# Altium schematic sheet Resolver.SchDoc
size A4; SheetNumber: 4; SheetTotal: 4
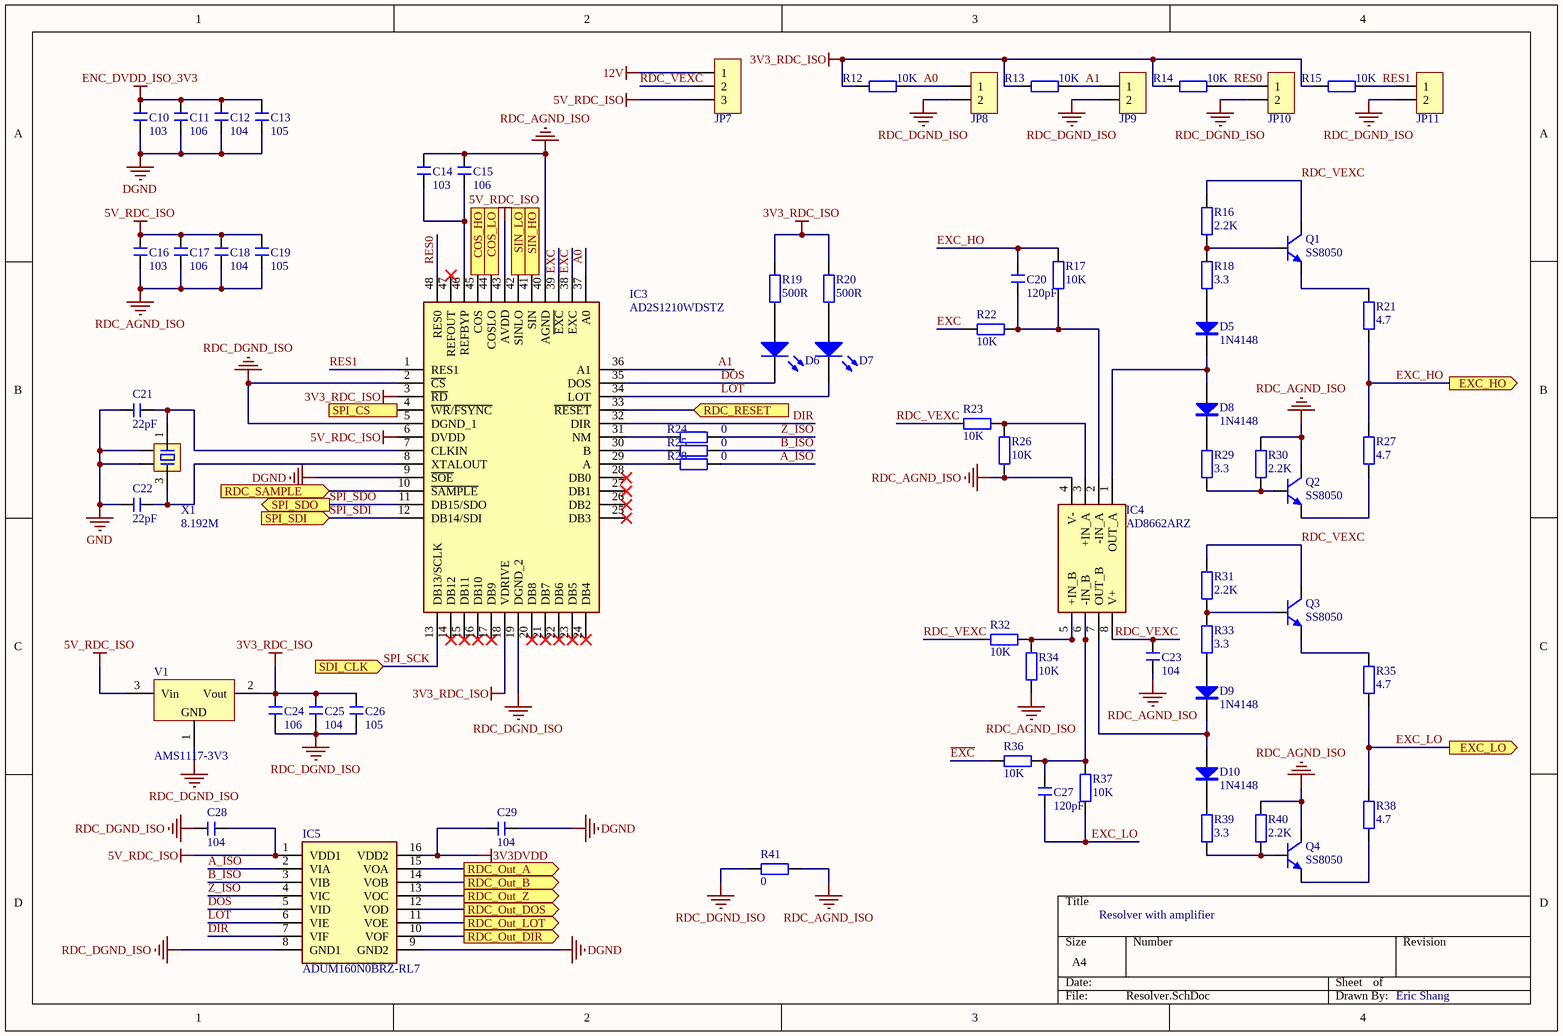
[diagram p0: Resolver.SchDoc]

## Parts
C10  103  [C 0603_L]
C11  106  [C 0603_L]
C12  104  [C 0603_L]
C13  105  [C 0603_L]
C14  103  [C 0603_L]
C15  106  [C 0603_L]
C16  103  [C 0603_L]
C17  106  [C 0603_L]
C18  104  [C 0603_L]
C19  105  [C 0603_L]
C20  120pF  [C 0603_L]
C21  22pF  [C 0603_L]
C22  22pF  [C 0603_L]
C23  104  [C 0603_L]
C24  106  [C 0603_L]
C25  104  [C 0603_L]
C26  105  [C 0603_L]
C27  120pF  [C 0603_L]
C28  104  [C 0603_L]
C29  104  [C 0603_L]
D5  1N4148  [MINI_MELF (LL34)]
D6  LED  [LED 0603W]  (value not drawn)
D7  LED  [LED 0603W]  (value not drawn)
D8  1N4148  [MINI_MELF (LL34)]
D9  1N4148  [MINI_MELF (LL34)]
D10  1N4148  [MINI_MELF (LL34)]
IC3  AD2S1210WDSTZ  [QFP50P900X900X160-48N]
IC4  AD8662ARZ  [SOIC127P600X175-8N]
IC5  ADUM160N0BRZ-RL7  [SOIC127P600X175-16N]
JP7  HDR-1X3  [HDR2.54-LI-3P]  (value not drawn)
JP8  HDR-1X2  [HDR2.54-LI-2P]  (value not drawn)
JP9  HDR-1X2  [HDR2.54-LI-2P]  (value not drawn)
JP10  HDR-1X2  [HDR2.54-LI-2P]  (value not drawn)
JP11  HDR-1X2  [HDR2.54-LI-2P]  (value not drawn)
Q1  SS8050  [SOT23-3N]
Q2  SS8050  [SOT23-3N]
Q3  SS8050  [SOT23-3N]
Q4  SS8050  [SOT23-3N]
R12  10K  [R 0603_L]
R13  10K  [R 0603_L]
R14  10K  [R 0603_L]
R15  10K  [R 0603_L]
R16  2.2K  [R 0603_L]
R17  10K  [R 0603_L]
R18  3.3  [R 0603_L]
R19  500R  [R 0603_L]
R20  500R  [R 0603_L]
R21  4.7  [R 1206_L]
R22  10K  [R 0603_L]
R23  10K  [R 0603_L]
R24  0  [R 0603_L]
R25  0  [R 0603_L]
R26  10K  [R 0603_L]
R27  4.7  [R 1206_L]
R28  0  [R 0603_L]
R29  3.3  [R 0603_L]
R30  2.2K  [R 0603_L]
R31  2.2K  [R 0603_L]
R32  10K  [R 0603_L]
R33  3.3  [R 0603_L]
R34  10K  [R 0603_L]
R35  4.7  [R 1206_L]
R36  10K  [R 0603_L]
R37  10K  [R 0603_L]
R38  4.7  [R 1206_L]
R39  3.3  [R 0603_L]
R40  2.2K  [R 0603_L]
R41  0  [R 1206_L]
V1  AMS1117-3V3  [SOT223_L]
X1  8.192M  [OSC 1612-4P]

## Ports
COS_HO (out), COS_LO (out), EXC_HO (out), EXC_LO (out), RDC_Out_A (out), RDC_Out_B (out), RDC_Out_DIR (out), RDC_Out_DOS (out), RDC_Out_LOT (out), RDC_Out_Z (out), RDC_RESET (in), RDC_SAMPLE (in), SDI_CLK (in), SIN_HO (out), SIN_LO (out), SPI_CS (in), SPI_SDI (in), SPI_SDO (out)

## Nets
3V3_RDC_ISO: C24.2 C25.2 C26.2 IC3.3(~{RD}) IC3.18(VDRIVE) R12.1 R13.1 R14.1 R15.1 R19.2 R20.2 V1.2(Vout)
3V3DVDD: C29.1 IC5.16(VDD2)
5V_RDC_ISO: C16.2 C17.2 C18.2 C19.2 C28.1 IC3.6(DVDD) IC3.43(AVDD) IC5.1(VDD1) JP7.3 V1.3(Vin)
12V: JP7.1
DGND: C10.1 C11.1 C12.1 C13.1 C29.2 IC3.9(~{SOE}) IC5.9(GND2)
ENC_DVDD_ISO_3V3: C10.2 C11.2 C12.2 C13.2
GND: C21.1 C22.1 X1.2 X1.4
RDC_AGND_ISO: C14.2 C15.2 C16.1 C17.1 C18.1 C19.1 C23.1 IC3.40(AGND) IC4.4(V-) Q2.3(C) Q4.3(C) R26.1 R30.2 R34.1 R40.2 R41.1
RDC_DGND_ISO: C24.1 C25.1 C26.1 C28.2 IC3.2(~{CS}) IC3.5(DGND_1) IC3.19(DGND_2) IC5.8(GND1) JP8.2 JP9.2 JP10.2 JP11.2 R41.2 V1.1(GND)
A0: IC3.37(A0) JP8.1 R12.2
A1: IC3.36(A1) JP9.1 R13.2
A_ISO: IC5.2(VIA) R28.2
B_ISO: IC5.3(VIB) R25.2
COS_HO: IC3.45(COS) ; port COS_HO
COS_LO: IC3.44(COSLO) ; port COS_LO
DIR: IC3.32(DIR) IC5.7(VIF)
DOS: D6.2(K) IC3.35(DOS) IC5.5(VID)
~{EXC}: IC3.39(~{EXC}) R36.1
EXC: IC3.38(EXC) R22.1
EXC_HO: C20.2 R17.2 R21.1 R27.2 ; port EXC_HO
EXC_LO: C27.1 R35.1 R37.1 R38.2 ; port EXC_LO
LOT: D7.2(K) IC3.34(LOT) IC5.6(VIE)
RDC_Out_A: IC5.15(VOA) ; port RDC_Out_A
RDC_Out_B: IC5.14(VOB) ; port RDC_Out_B
RDC_Out_DIR: IC5.10(VOF) ; port RDC_Out_DIR
RDC_Out_DOS: IC5.12(VOD) ; port RDC_Out_DOS
RDC_Out_LOT: IC5.11(VOE) ; port RDC_Out_LOT
RDC_Out_Z: IC5.13(VOC) ; port RDC_Out_Z
RDC_RESET: IC3.33(~{RESET}) ; port RDC_RESET
RDC_SAMPLE: IC3.10(~{SAMPLE}) ; port RDC_SAMPLE
RDC_VEXC: C23.2 IC4.8(V+) JP7.2 Q1.3(C) Q3.3(C) R16.2 R23.1 R31.2 R32.1
RES0: IC3.48(RES0) JP10.1 R14.2
RES1: IC3.1(RES1) JP11.1 R15.2
SIN_HO: IC3.41(SIN) ; port SIN_HO
SIN_LO: IC3.42(SINLO) ; port SIN_LO
SPI_CS: IC3.4(~{WR}/~{FSYNC}) ; port SPI_CS
SPI_SCK: IC3.13(DB13/SCLK) ; port SDI_CLK
SPI_SDI: IC3.12(DB14/SDI) ; port SPI_SDI
SPI_SDO: IC3.11(DB15/SDO) ; port SPI_SDO
Z_ISO: IC5.4(VIC) R24.2
NetC14_1: C14.1 C15.1 IC3.46(REFBYP)
NetC20_1: C20.1 IC4.2(-IN_A) R17.1 R22.2
NetC21_2: C21.2 IC3.7(CLKIN) X1.1
NetC22_2: C22.2 IC3.8(XTALOUT) X1.3
NetC27_2: C27.2 IC4.6(-IN_B) R36.2 R37.2
NetD5_1: D5.1(A) R18.1
NetD5_2: D5.2(K) D8.1(A) IC4.1(OUT_A)
NetD6_1: D6.1(A) R19.1
NetD7_1: D7.1(A) R20.1
NetD8_2: D8.2(K) R29.2
NetD9_1: D9.1(A) R33.1
NetD9_2: D9.2(K) D10.1(A) IC4.7(OUT_B)
NetD10_2: D10.2(K) R39.2
NetIC3_29: IC3.29(A) R28.1
NetIC3_30: IC3.30(B) R25.1
NetIC3_31: IC3.31(NM) R24.1
NetIC4_3: IC4.3(+IN_A) R23.2 R26.2
NetIC4_5: IC4.5(+IN_B) R32.2 R34.2
NetQ1_1: Q1.1(B) R16.1 R18.2
NetQ1_2: Q1.2(E) R21.2
NetQ2_1: Q2.1(B) R29.1 R30.1
NetQ2_2: Q2.2(E) R27.1
NetQ3_1: Q3.1(B) R31.1 R33.2
NetQ3_2: Q3.2(E) R35.2
NetQ4_1: Q4.1(B) R39.1 R40.1
NetQ4_2: Q4.2(E) R38.1

Not connected (* = marked no-connect by the designer): IC3 14(DB12)* 15(DB11)* 16(DB10)* 17(DB9)* 20(DB8)* 21(DB7)* 22(DB6)* 23(DB5)* 24(DB4)* 25(DB3)* 26(DB2)* 27(DB1)* 28(DB0)* 47(REFOUT)*

## Notes on the sheet
- Resolver with amplifier
- Eric Shang

## Library data of the parts
C10-C29 = C: 贴片电容; BOM名称: 无极性贴片电容; 淘宝ID: 封装库来自淘宝 ID：黄晶宝石; 联系售后，技术支持: https://shop463601444.taobao.com; 唯一出售店铺网址: https://shop463601444.taobao.com
D5 D8-D10 = 1N4148: 开关二极管; BOM名称: 高速开关二极管; 淘宝ID: 封装库来自淘宝 ID：黄晶宝石; 欢迎光临: https://shop463601444.taobao.com
D6 D7 = LED: 发光二极管; 技术支持，联系售后: https://shop463601444.taobao.com
IC3 = AD2S1210WDSTZ: Integrated Circuit; Manufacturer_Name: Analog Devices; Datasheet Link: https://www.analog.com/AD2S1210/datasheet; Height: 1.6mm; Manufacturer_Part_Number: AD2S1210WDSTZ; Mouser Part Number: 584-AD2S1210WDSTZ; Mouser Price/Stock: https://www.mouser.co.uk/ProductDetail/Analog-Devices/AD2S1210WDSTZ?qs=ZSGLvWohUNk0AkxKY2QFgw%3D%3D; Arrow Part Number: AD2S1210WDSTZ; Arrow Price/Stock: https://www.arrow.com/en/products/ad2s1210wdstz/analog-devices?region=asia
IC4 = AD8662ARZ: Integrated Circuit; Manufacturer_Name: Analog Devices; Datasheet Link: http://www.analog.com/static/imported-files/data_sheets/AD8661_8662.pdf; Height: 1.75mm; Manufacturer_Part_Number: AD8662ARZ; Mouser Part Number: 584-AD8662ARZ; Mouser Price/Stock: https://www.mouser.co.uk/ProductDetail/Analog-Devices/AD8662ARZ?qs=%2FtpEQrCGXCxD9FnBk1Cc6w%3D%3D; Arrow Part Number: AD8662ARZ; Arrow Price/Stock: https://www.arrow.com/en/products/ad8662arz/analog-devices?region=nac
IC5 = ADUM160N0BRZ-RL7: Integrated Circuit; Manufacturer_Name: Analog Devices; Datasheet Link: https://www.analog.com/media/en/technical-documentation/data-sheets/adum160n-161n-162n-163n.pdf; Height: 1.75mm; Manufacturer_Part_Number: ADUM160N0BRZ-RL7; Mouser Part Number: 584-ADUM160N0BRZ-RL7; Mouser Price/Stock: https://www.mouser.co.uk/ProductDetail/Analog-Devices/ADUM160N0BRZ-RL7?qs=cslStgdnz9OW1mXsMBZKfA%3D%3D; Arrow Part Number: ADUM160N0BRZ-RL7; Arrow Price/Stock: https://www.arrow.com/en/products/adum160n0brz-rl7/analog-devices
JP7 = Header 3: 3P接插件; 版权归属: 封装库来自淘宝 ID：黄晶宝石; BOM名称: 3P接插件; 学习资源: https://shop463601444.taobao.com
JP8-JP11 = Header 2: 2P接插件; 版权归属: 封装库来自淘宝 ID：黄晶宝石; BOM名称: 2P接插件; 联系售后: https://shop463601444.taobao.com
Q1-Q4 = 8050-SMD: 高频放大-NPN型; 版权归属: 封装库来自淘宝 ID：黄晶宝石; 属性: 40V 1.5A 1W 100MHZ; BOM名称: 高频放大-NPN型; 联系售后: https://shop463601444.taobao.com
R12-R41 = R: 贴片电阻; 版权归属: 来自淘宝 ID：黄晶宝石; 封装库来自淘宝卖家 ID：黄晶宝石: 其他店铺购入均为盗版，不享受售后技术支持服务，请立即申请退款; BOM名称: 贴片电阻; 联系售后: https://shop463601444.taobao.com
V1 = AMS1117: 三端稳压芯片; BOM名称: 稳压芯片; 淘宝ID: 封装库来自淘宝 ID：黄晶宝石; 欢迎光临淘宝店铺: https://shop463601444.taobao.com
X1 = XTAL-4P: 4脚无源晶振; 版权归属: 封装库来自淘宝卖家 ID：黄晶宝石; BOM名称: 4脚无源晶振; 学习资源: https://shop463601444.taobao.com